# EAGLE schematic Wiring Diagram (EAGLE 8.5.0)
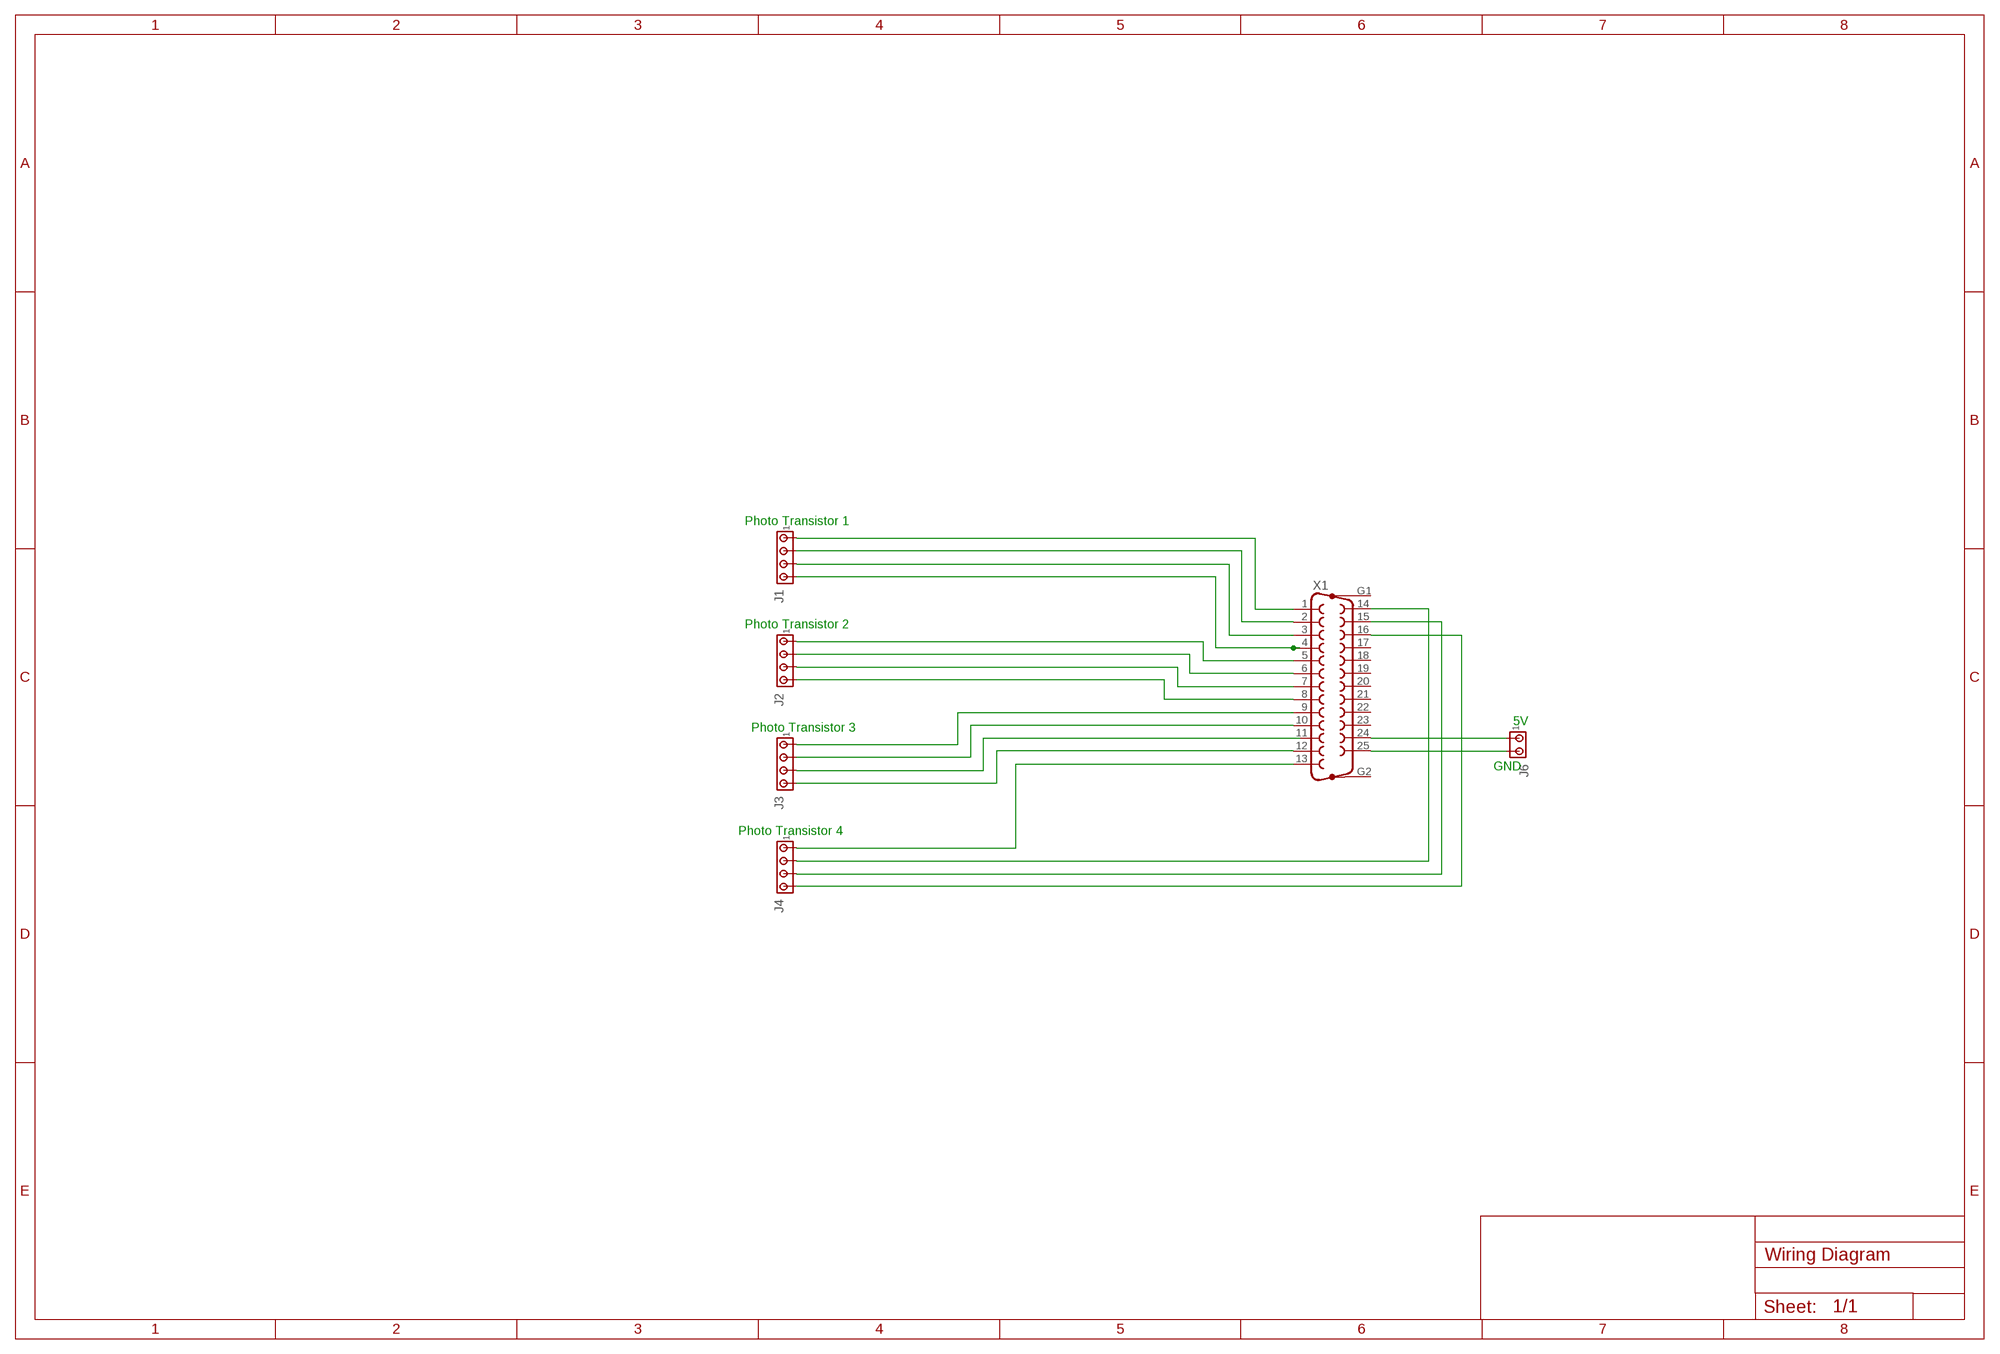
[diagram p0: schematic, sheet 1]

## Parts
J1  MTA04-100  [10X04MTA]
J2  MTA04-100  [10X04MTA]
J3  MTA04-100  [10X04MTA]
J4  MTA04-100  [10X04MTA]
J6  MTA02-100  [10X02MTA]
X1  F25HP  [F25HP]

## Nets
N$1: J1.1 X1.1
N$2: J1.2 X1.2
N$3: J1.3 X1.3
N$4: J1.4 X1.4
N$5: J2.1 X1.5
N$6: J2.2 X1.6
N$7: J2.3 X1.7
N$8: J2.4 X1.8
N$9: J3.1 X1.9
N$10: J3.2 X1.10
N$11: J3.3 X1.11
N$12: J3.4 X1.12
N$13: J4.1 X1.13
N$14: J4.2 X1.14
N$15: J4.3 X1.15
N$16: J4.4 X1.16
N$17: J6.2 X1.25
N$18: J6.1 X1.24
Unconnected: X1.17 X1.18 X1.19 X1.20 X1.21 X1.22 X1.23 X1.G1 X1.G2

## Notes on the sheet
- Photo Transistor 1
- Photo Transistor 2
- 5V
- Photo Transistor 3
- GND
- Photo Transistor 4

## Library data of the parts
J1-J4 = con-amp:MTA04-100: AMP connector
J6 = con-amp:MTA02-100: AMP connector
X1 = con-subd:F25HP: SUB-D; OC_FARNELL: unknown; OC_NEWARK: unknown